# EAGLE design cryobondr-qbit2-aqc-rev2 (EAGLE 9.0.0)
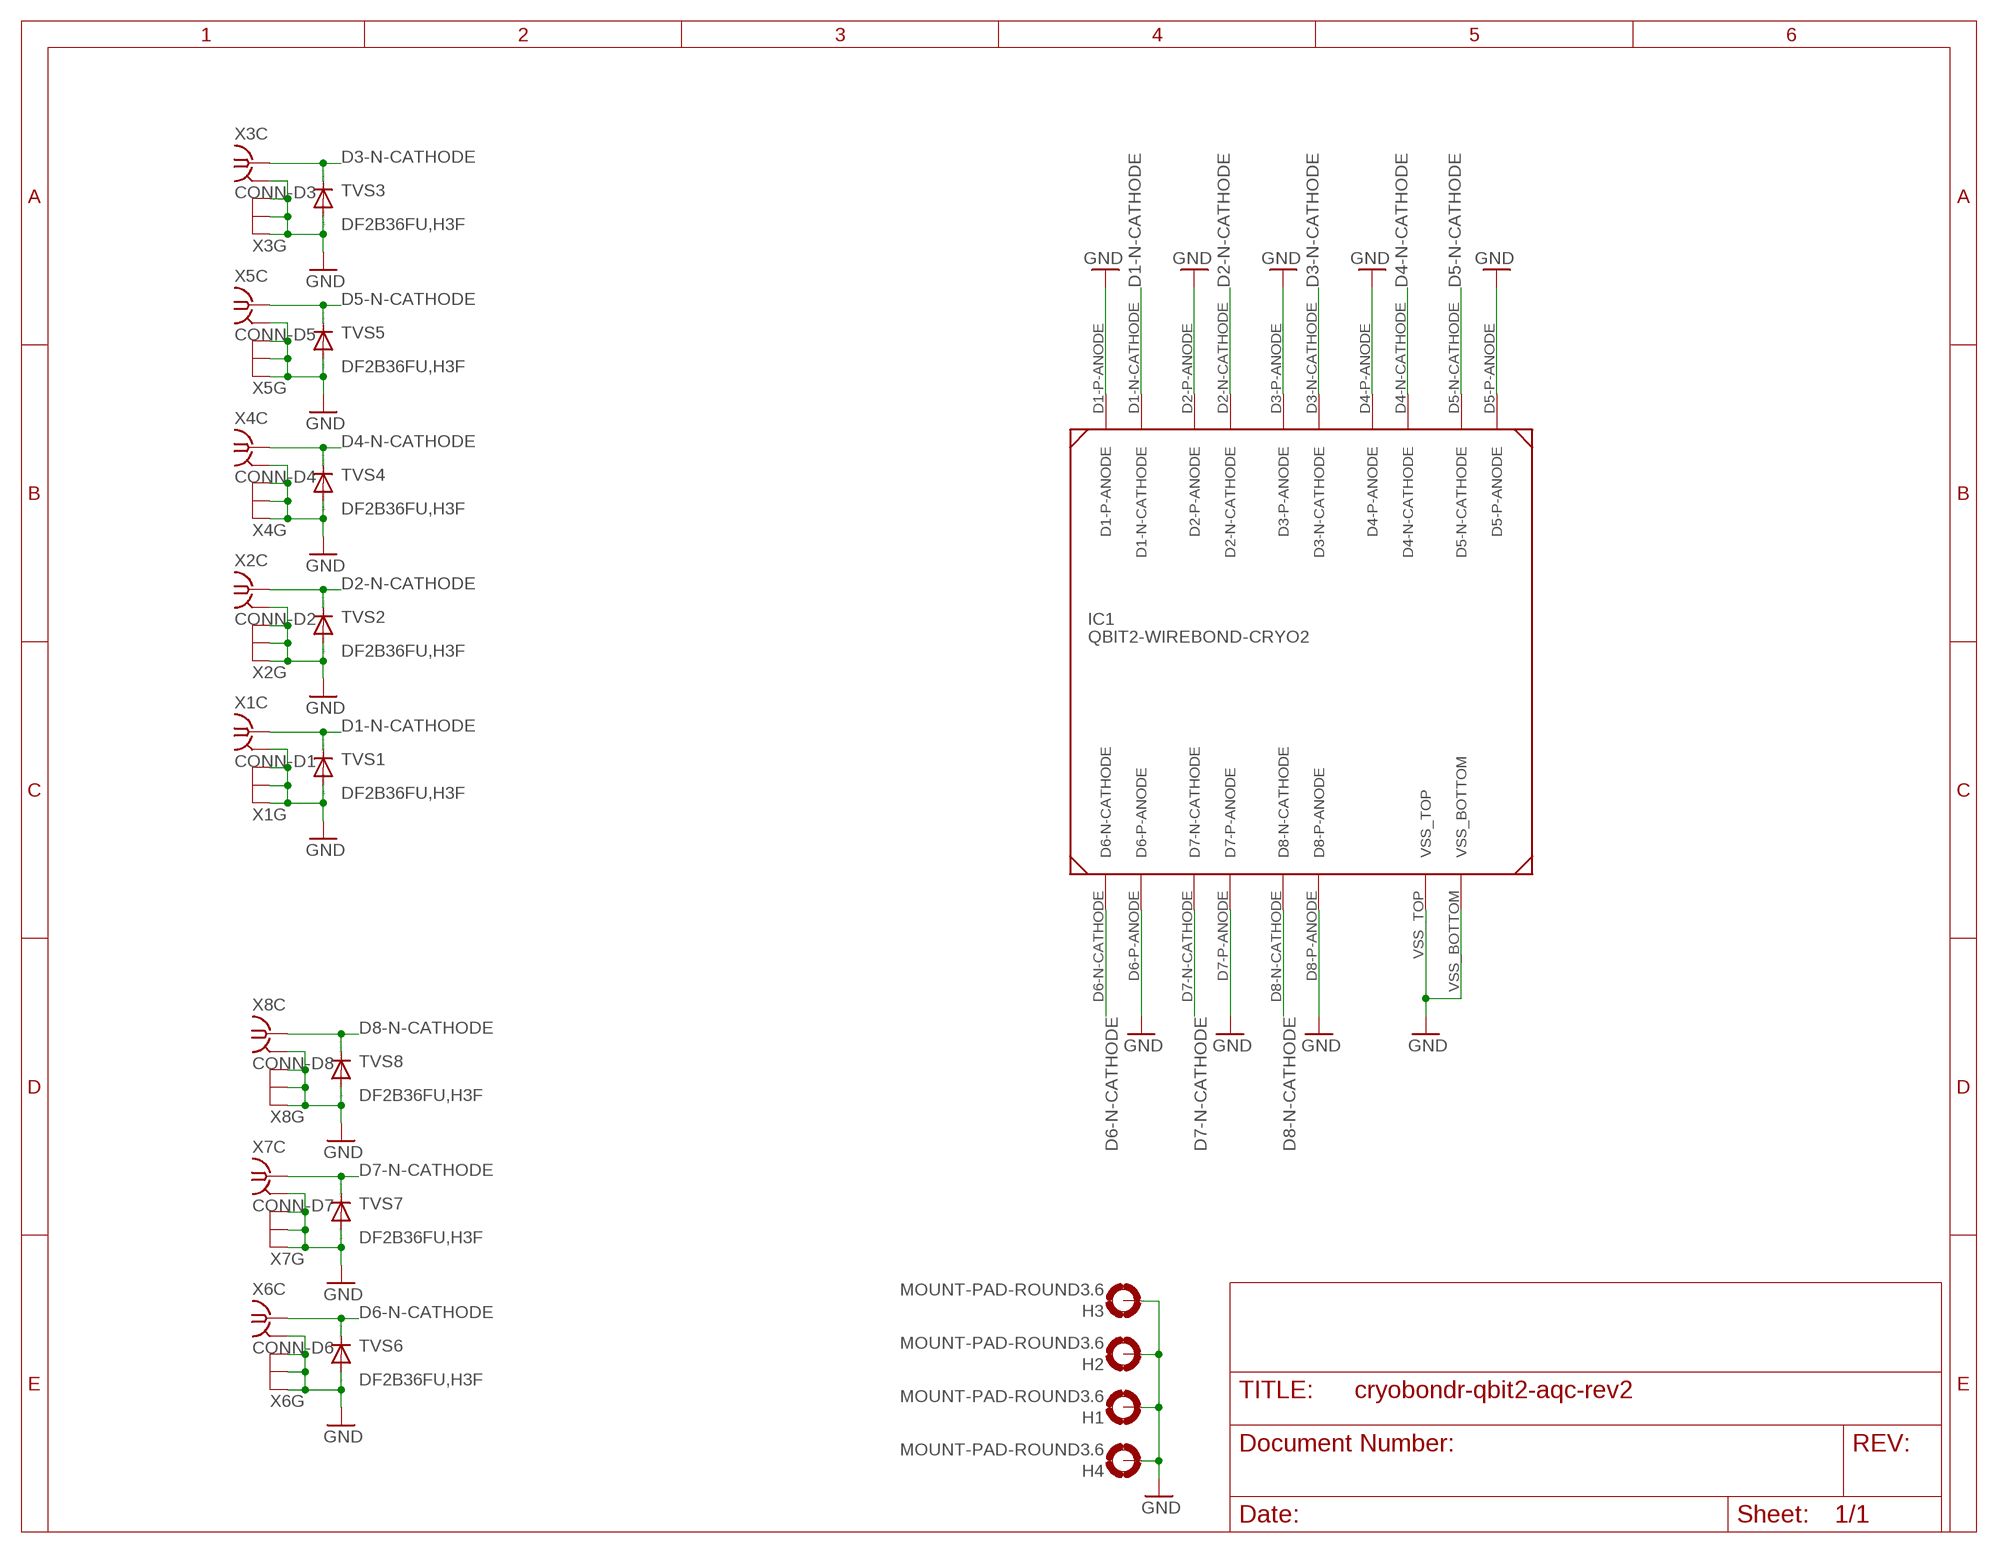
[diagram p0: schematic, sheet 1]

## Parts
H1  MOUNT-PAD-ROUND3.6  [3,6-PAD]
H2  MOUNT-PAD-ROUND3.6  [3,6-PAD]
H3  MOUNT-PAD-ROUND3.6  [3,6-PAD]
H4  MOUNT-PAD-ROUND3.6  [3,6-PAD]
IC1  QBIT2-WIREBOND-CRYO2  [QBIT2-WIREBOND-CRYO2]
TVS1  DF2B36FU,H3F  DIODE-SOD323-R  [SOD323-R]
TVS2  DF2B36FU,H3F  DIODE-SOD323-R  [SOD323-R]
TVS3  DF2B36FU,H3F  DIODE-SOD323-R  [SOD323-R]
TVS4  DF2B36FU,H3F  DIODE-SOD323-R  [SOD323-R]
TVS5  DF2B36FU,H3F  DIODE-SOD323-R  [SOD323-R]
TVS6  DF2B36FU,H3F  DIODE-SOD323-R  [SOD323-R]
TVS7  DF2B36FU,H3F  DIODE-SOD323-R  [SOD323-R]
TVS8  DF2B36FU,H3F  DIODE-SOD323-R  [SOD323-R]
X1  CONN-D1  MMCXBIGPAD  [MMCX-SMT-BIGPADS]
X2  CONN-D2  MMCXBIGPAD  [MMCX-SMT-BIGPADS]
X3  CONN-D3  MMCXBIGPAD  [MMCX-SMT-BIGPADS]
X4  CONN-D4  MMCXBIGPAD  [MMCX-SMT-BIGPADS]
X5  CONN-D5  MMCXBIGPAD  [MMCX-SMT-BIGPADS]
X6  CONN-D6  MMCXBIGPAD  [MMCX-SMT-BIGPADS]
X7  CONN-D7  MMCXBIGPAD  [MMCX-SMT-BIGPADS]
X8  CONN-D8  MMCXBIGPAD  [MMCX-SMT-BIGPADS]

## Nets
D1-N-CATHODE: IC1.D1-N-CATHODE TVS1.C X1.S
D2-N-CATHODE: IC1.D2-N-CATHODE TVS2.C X2.S
D3-N-CATHODE: IC1.D3-N-CATHODE TVS3.C X3.S
D4-N-CATHODE: IC1.D4-N-CATHODE TVS4.C X4.S
D5-N-CATHODE: IC1.D5-N-CATHODE TVS5.C X5.S
D6-N-CATHODE: IC1.D6-N-CATHODE TVS6.C X6.S
D7-N-CATHODE: IC1.D7-N-CATHODE TVS7.C X7.S
D8-N-CATHODE: IC1.D8-N-CATHODE TVS8.C X8.S
GND: H1.B3,6(MOUNT) H2.B3,6(MOUNT) H3.B3,6(MOUNT) H4.B3,6(MOUNT) IC1.D1-P-ANODE IC1.D2-P-ANODE IC1.D3-P-ANODE IC1.D4-P-ANODE IC1.D5-P-ANODE IC1.D6-P-ANODE IC1.D7-P-ANODE IC1.D8-P-ANODE IC1.VSS_BOTTOM IC1.VSS_TOP TVS1.A TVS2.A TVS3.A TVS4.A TVS5.A TVS6.A TVS7.A TVS8.A X1.G1(C:GND) X1.G2(G:GND) X1.G3(G:GND) X1.G4(G:GND) X2.G1(C:GND) X2.G2(G:GND) X2.G3(G:GND) X2.G4(G:GND) X3.G1(C:GND) X3.G2(G:GND) X3.G3(G:GND) X3.G4(G:GND) X4.G1(C:GND) X4.G2(G:GND) X4.G3(G:GND) X4.G4(G:GND) X5.G1(C:GND) X5.G2(G:GND) X5.G3(G:GND) X5.G4(G:GND) X6.G1(C:GND) X6.G2(G:GND) X6.G3(G:GND) X6.G4(G:GND) X7.G1(C:GND) X7.G2(G:GND) X7.G3(G:GND) X7.G4(G:GND) X8.G1(C:GND) X8.G2(G:GND) X8.G3(G:GND) X8.G4(G:GND)

## Library data of the parts
H1-H4 = holes:MOUNT-PAD-ROUND: MOUNTING PAD, round
IC1 = meng:QBIT2-WIREBOND-CRYO2
TVS1-TVS8 = diode:DIODE-: DIODE
X1-X8 = meng:MMCX

## Net classes
0 default: width 0.102 mm, clearance 0.102 mm

## Board
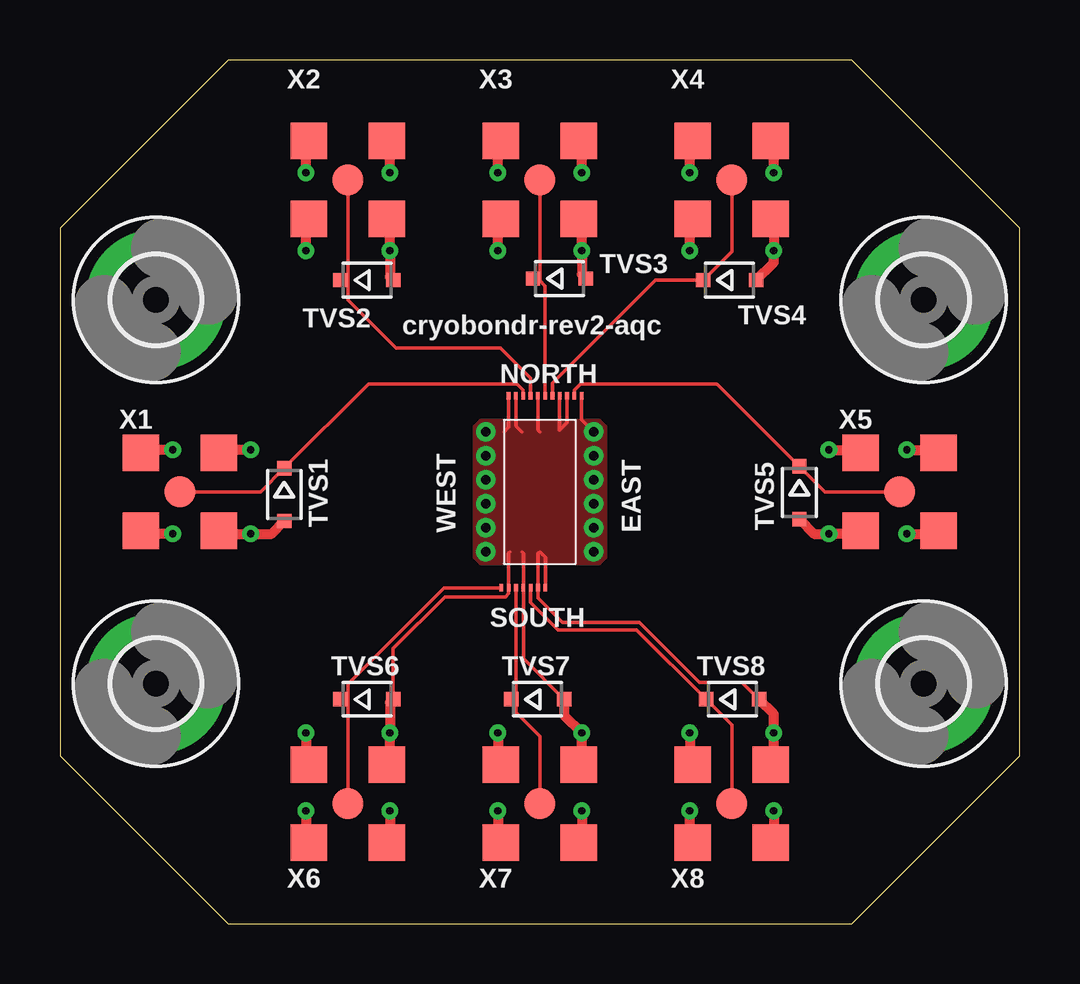
[diagram p1: board, top side]
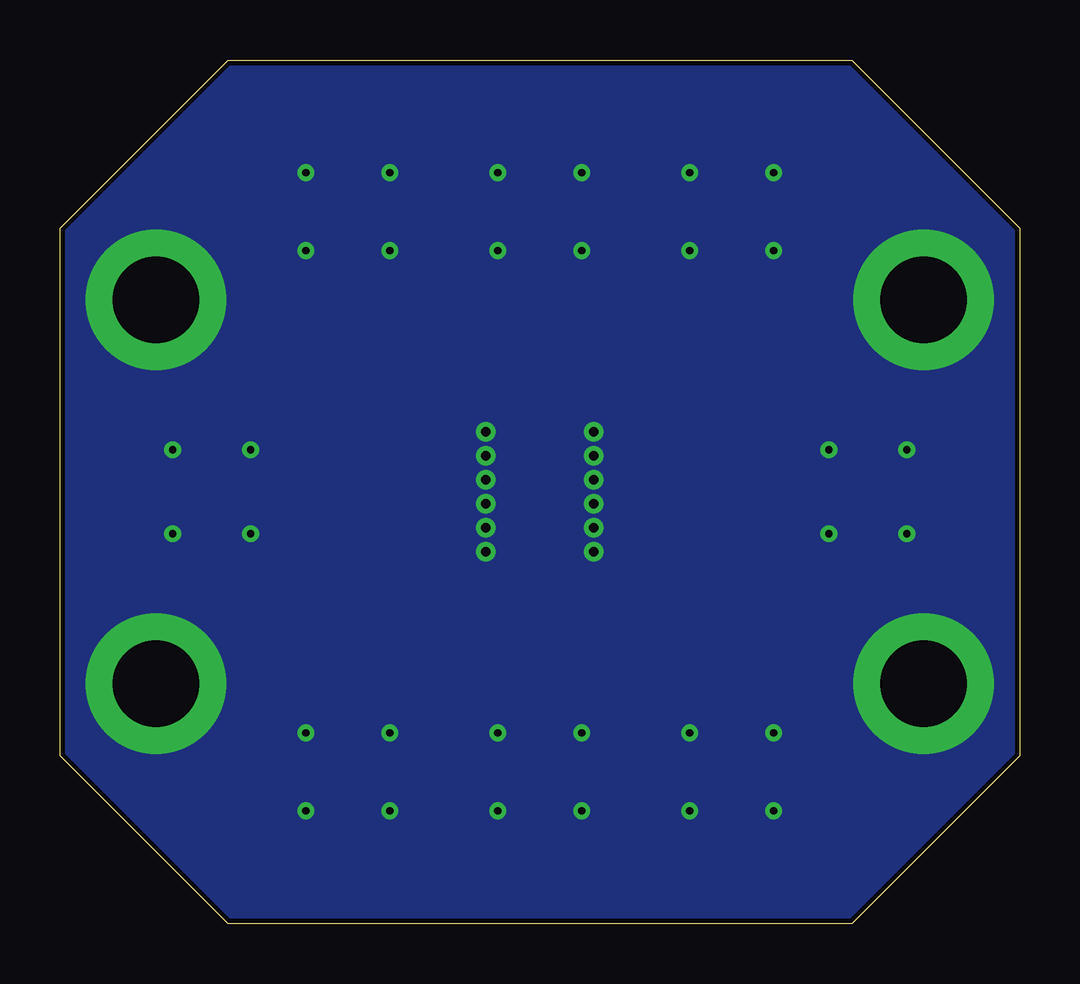
[diagram p2: board, bottom side, seen from below]

Size 40 x 36 mm. Coordinates in mm from the lower left corner, seen from the top.
Outline: 7,0 33,0 40,7 40,29 33,36 7,36 0,29 0,7 7,0
Copper layers (1*16): Top 0.035mm / dielectric 1.5mm / Bottom 0.035mm
Design rules "default *": minimum track width 4mil, minimum drill 0.3mm, track to track 6mil, track to pad 6mil, pad to pad 6mil, via to via 6mil, smd to smd 0mil, copper to edge 8mil, drill to drill 8mil, minimum pad ring 10mil, minimum via ring 8mil, stop-mask expansion 2mil, vias tented up to drill 15mil, thermal gap 10mil

### Footprints (pad centres in the part's own frame; a part is rotated, then mirrored left to right if it is on the bottom)
3,6-PAD = drill 3.6 pad 5.842: B3,6 0,0
QBIT2-WIREBOND-CRYO2 = smd 0.152 x 0.305: D1-N-CATHODE -0.691,4; D1-P-ANODE -0.996,4; D2-N-CATHODE -0.386,4; D2-P-ANODE -0.082,4; D3-N-CATHODE 0.223,4; D3-P-ANODE 1.138,4; D4-N-CATHODE 0.528,4; D4-P-ANODE 0.833,4; D5-N-CATHODE 1.442,4; D5-P-ANODE 1.747,4; D6-N-CATHODE -1.598,-4; D6-P-ANODE -1.293,-4; D7-N-CATHODE -0.988,-4; D7-P-ANODE -0.683,-4; D8-N-CATHODE -0.378,-4; D8-P-ANODE -0.074,-4; VSS_BOTTOM 0.231,-4; VSS_TOP -1.301,4
SOD323-R = smd 0.6 x 0.6: A 1.1,0; C -1.1,0
MMCX-SMT-BIGPADS = smd 1.524 x 1.524: G1 -1.626,1.626; G2 1.626,1.626; G3 1.626,-1.626; G4 -1.626,-1.626 | smd 1.27 x 1.27: S 0,0

### Placement (x,y rotation side)
H1  36,10 0 top
H2  4,10 0 top
H3  36,26 0 top
H4  4,26 0 top
IC1  20,18 0 top
TVS1  9.35,17.88 270 top
TVS2  12.79,26.82 0 top
TVS3  20.82,26.89 0 top
TVS4  27.91,26.82 0 top
TVS5  30.82,17.96 270 top
TVS6  12.79,9.35 0 top
TVS7  19.91,9.35 0 top
TVS8  28.04,9.35 0 top
X1  5,18 0 top
X2  12,31 0 top
X3  20,31 90 top
X4  28,31 0 top
X5  35,18 270 top
X6  12,5 0 top
X7  20,5 0 top
X8  28,5 0 top

### Tracks (layer width: path | path; a pad name or v marks a point on that pad's centre or on a via)
D1-N-CATHODE
  Top 0.152: IC1.D1-N-CATHODE 19.31,22.25 19.06,22.5 12.87,22.5 TVS1.C 8.37,18 X1.S
D2-N-CATHODE
  Top 0.152: X2.S 12,26.75 | 12,26.75 12,26 14,24 18.36,24 19.61,22.75 IC1.D2-N-CATHODE | TVS2.C 11.93,26.82 12,26.75
D3-N-CATHODE
  Top 0.152: IC1.D3-N-CATHODE 20.22,26.58 20,26.8 | 20,26.8 X3.S | 20,26.8 19.8,26.8 TVS3.C
D4-N-CATHODE
  Top 0.152: IC1.D4-N-CATHODE 20.53,22.53 24.82,26.82 TVS4.C 28,28.01 X4.S
D5-N-CATHODE
  Top 0.152: IC1.D5-N-CATHODE 21.44,22.25 21.7,22.5 27.38,22.5 TVS5.C 31.88,18 X5.S
D6-N-CATHODE
  Top 0.152: 12,9.25 12,10 16,14 IC1.D6-N-CATHODE | 12,9.25 X6.S | TVS6.C 11.9,9.35 12,9.25
D7-N-CATHODE
  Top 0.152: X7.S 20,7.81 19.01,8.8 19.01,9.25 | IC1.D7-N-CATHODE 19.01,9.25 | TVS7.C 18.91,9.35 19.01,9.25
D8-N-CATHODE
  Top 0.152: IC1.D8-N-CATHODE 19.62,13.38 20.75,12.25 24.04,12.25 TVS8.C 28,8.29 X8.S
GND  (via drill 0.3, 0.4)
  Top 0.152: 18.75,15.5 18.71,15.46 IC1.D6-P-ANODE 18.71,13.75 18.57,13.62 16.05,13.62 13.89,11.46 TVS6.A | 19.25,15.5 19.32,15.43 IC1.D7-P-ANODE 19.32,11.04 TVS7.A | IC1.VSS_BOTTOM 20.23,15.27 20,15.5 19.93,15.43 IC1.D8-P-ANODE 19.93,13.57 20.95,12.55 24.16,12.55 26.66,10.06 28.43,10.06 TVS8.A | IC1.VSS_TOP 18.7,20.7 18.5,20.5 | IC1.D1-P-ANODE 19,20.75 19.25,20.5 | IC1.D2-P-ANODE 19.92,20.58 20,20.5 | IC1.D4-P-ANODE 20.83,20.58 21.14,20.89 IC1.D3-P-ANODE | IC1.D5-P-ANODE 21.75,21 v22.25,20.5
  Top 0.406: v4.7,19.75 3.5,19.75 X1.G1 | v7.95,19.75 6.75,19.75 X1.G2 | v4.7,16.25 3.5,16.25 X1.G4 | X1.G3 6.75,16.25 v7.95,16.25 8.82,16.25 TVS1.A | X8.G4 26.25,3.5 v26.25,4.7 | v29.75,4.7 29.75,3.5 X8.G3 | X8.G2 29.75,6.75 v29.75,7.95 29.75,8.74 TVS8.A | v26.25,7.95 26.25,6.75 X8.G1 | v21.75,4.7 21.75,3.5 X7.G3 | v18.25,4.7 18.25,3.5 X7.G4 | v18.25,7.95 18.25,6.75 X7.G1 | X7.G2 21.75,6.75 v21.75,7.95 21.01,8.69 TVS7.A | v13.75,4.7 13.75,3.5 X6.G3 | v10.25,4.7 10.25,3.5 X6.G4 | v10.25,7.95 10.25,6.75 X6.G1 | X6.G2 13.75,6.75 v13.75,7.95 13.75,9.21 TVS6.A | X3.G4 21.75,29.25 v21.75,28.05 21.75,27.05 TVS3.A | v21.75,31.3 21.75,32.5 X3.G3 | v18.25,31.3 18.25,32.5 X3.G2 | v18.25,28.05 18.25,29.25 X3.G1 | v35.3,19.75 36.5,19.75 X5.G1 | v35.3,16.25 36.5,16.25 X5.G2 | X5.G3 33.25,16.25 v32.05,16.25 31.43,16.25 TVS5.A | v32.05,19.75 33.25,19.75 X5.G4 | X4.G3 29.75,29.25 v29.75,28.05 29.75,27.56 TVS4.A | v29.75,31.3 29.75,32.5 X4.G2 | v26.25,31.3 26.25,32.5 X4.G1 | v26.25,28.05 26.25,29.25 X4.G4 | X2.G3 13.75,29.25 v13.75,28.05 13.75,26.96 TVS2.A | v13.75,31.3 13.75,32.5 X2.G2 | v10.25,31.3 10.25,32.5 X2.G1 | v10.25,28.05 10.25,29.25 X2.G4
  other vias: 17.75,20.5 17.75,19.5 17.75,18.5 17.75,17.5 17.75,16.5 17.75,15.5 22.25,19.5 22.25,18.5 22.25,17.5 22.25,16.5 22.25,15.5
  pour Bottom (no thermals): 0,0 40,0 40,36 0,36
  pour Top: 17.25,15.25 17.5,15 22.5,15 22.75,15.25 22.75,20.75 22.5,21 17.5,21 17.25,20.75

### Text on the board
tPlace: cryobondr-rev2-aqc | NORTH | WEST | EAST | SOUTH